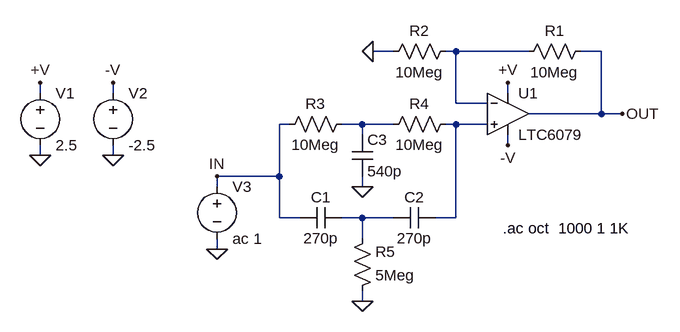
[diagram p0: schematic 6079.asc]
6079.asc, the LTspice schematic file:
Version 4
SHEET 1 880 820
WIRE 48 320 16 320
WIRE 144 320 128 320
WIRE 256 320 144 320
WIRE 368 320 336 320
WIRE -496 384 -496 368
WIRE -384 384 -384 368
WIRE 224 384 224 368
WIRE 144 400 144 320
WIRE 192 400 144 400
WIRE 368 416 368 320
WIRE 368 416 256 416
WIRE 400 416 368 416
WIRE -112 432 -128 432
WIRE 0 432 -32 432
WIRE 48 432 0 432
WIRE 144 432 128 432
WIRE 192 432 144 432
WIRE 0 448 0 432
WIRE 224 464 224 448
WIRE -496 480 -496 464
WIRE -384 480 -384 464
WIRE -128 512 -128 432
WIRE -128 512 -224 512
WIRE -224 528 -224 512
WIRE 0 528 0 512
WIRE -128 576 -128 512
WIRE -96 576 -128 576
WIRE 0 576 -32 576
WIRE 48 576 0 576
WIRE 144 576 144 432
WIRE 144 576 112 576
WIRE 0 608 0 576
WIRE -224 624 -224 608
WIRE 0 704 0 688
FLAG -496 480 0
FLAG -496 368 +V
FLAG -384 480 0
FLAG -384 368 -V
FLAG -224 624 0
FLAG 16 320 0
FLAG 0 704 0
FLAG 0 528 0
FLAG 400 416 OUT
FLAG -224 512 IN
FLAG 224 368 +V
FLAG 224 464 -V
SYMBOL voltage -496 368 R0
SYMATTR InstName V1
SYMATTR Value 2.5
SYMBOL voltage -384 368 R0
SYMATTR InstName V2
SYMATTR Value -2.5
SYMBOL voltage -224 512 R0
SYMATTR InstName V3
SYMATTR Value ac 1
SYMBOL res 352 304 R90
WINDOW 0 0 56 VBottom 2
WINDOW 3 32 56 VTop 2
SYMATTR InstName R1
SYMATTR Value 10Meg
SYMBOL res 144 304 R90
WINDOW 0 0 56 VBottom 2
WINDOW 3 32 56 VTop 2
SYMATTR InstName R2
SYMATTR Value 10Meg
SYMBOL res -16 416 R90
WINDOW 0 0 56 VBottom 2
WINDOW 3 32 56 VTop 2
SYMATTR InstName R3
SYMATTR Value 10Meg
SYMBOL res 144 416 R90
WINDOW 0 0 56 VBottom 2
WINDOW 3 32 56 VTop 2
SYMATTR InstName R4
SYMATTR Value 10Meg
SYMBOL res -16 704 M180
WINDOW 0 36 76 Left 2
WINDOW 3 36 40 Left 2
SYMATTR InstName R5
SYMATTR Value 5Meg
SYMBOL cap -32 560 R90
WINDOW 0 0 32 VBottom 2
WINDOW 3 32 32 VTop 2
SYMATTR InstName C1
SYMATTR Value 270p
SYMBOL cap 112 560 R90
WINDOW 0 0 32 VBottom 2
WINDOW 3 32 32 VTop 2
SYMATTR InstName C2
SYMATTR Value 270p
SYMBOL cap -16 448 R0
SYMATTR InstName C3
SYMATTR Value 540p
SYMBOL opamps\\LTC6079 224 416 R0
SYMATTR InstName U1
TEXT 216 592 Left 2 !.ac oct  1000 1 1K

The netlist it stands for:
* 6079.asc
V1 +V 0 2.5
V2 -V 0 -2.5
V3 IN 0 ac 1
R1 OUT N001 10Meg
R2 N001 0 10Meg
R3 N002 IN 10Meg
R4 N003 N002 10Meg
R5 0 N004 5Meg
C1 N004 IN 270p
C2 N003 N004 270p
C3 N002 0 540p
XU1 N003 N001 +V -V OUT LTC6078  ; LTC6079, pins In+ In- V+ V- OUT
.ac oct  1000 1 1K
.lib LTC5.lib
.backanno
.end